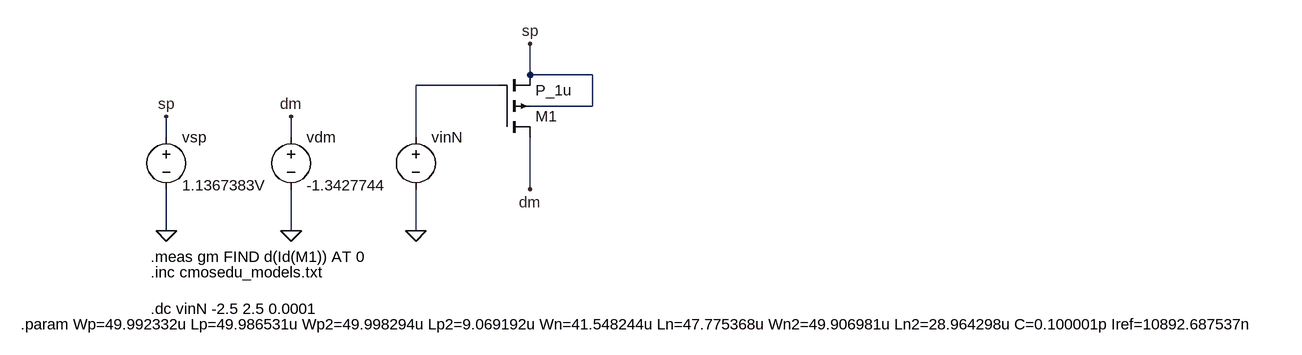
[diagram p0: schematic GM1.asc]
GM1.asc, the LTspice schematic file:
Version 4
SHEET 1 2468 680
WIRE 1056 -112 1056 -160
WIRE 1152 -112 1056 -112
WIRE 1008 -96 880 -96
WIRE 1152 -64 1152 -112
WIRE 1152 -64 1056 -64
WIRE 496 -16 496 -48
WIRE 688 -16 688 -48
WIRE 880 -16 880 -96
WIRE 1056 64 1056 -16
WIRE 496 128 496 64
WIRE 688 128 688 64
WIRE 880 128 880 64
FLAG 880 128 0
FLAG 496 -48 sp
FLAG 496 128 0
FLAG 1056 -160 sp
FLAG 688 -48 dm
FLAG 688 128 0
FLAG 1056 64 dm
SYMBOL voltage 880 -32 R0
WINDOW 3 24 44 Left 2
WINDOW 123 0 0 Left 2
WINDOW 39 0 0 Left 2
SYMATTR Value ""
SYMATTR InstName vinN
SYMBOL voltage 496 -32 R0
WINDOW 123 0 0 Left 2
WINDOW 39 0 0 Left 2
WINDOW 3 24 90 Left 2
SYMATTR Value 1.1367383V
SYMATTR InstName vsp
SYMBOL voltage 688 -32 R0
WINDOW 123 0 0 Left 2
WINDOW 39 0 0 Left 2
WINDOW 3 24 90 Left 2
SYMATTR Value -1.3427744
SYMATTR InstName vdm
SYMBOL pmos4 1008 -16 M180
SYMATTR InstName M1
SYMATTR Value2 l={Lp2} w={Wp2}
SYMATTR Value P_1u
TEXT 472 192 Left 2 !.inc cmosedu_models.txt
TEXT 472 248 Left 2 !.dc vinN -2.5 2.5 0.0001
TEXT 472 168 Left 2 !.meas gm FIND d(Id(M1)) AT 0
TEXT 272 272 Left 2 !.param Wp=49.992332u Lp=49.986531u Wp2=49.998294u Lp2=9.069192u Wn=41.548244u Ln=47.775368u Wn2=49.906981u Ln2=28.964298u C=0.100001p Iref=10892.687537n

The netlist it stands for:
* GM1.asc
vinN N001 0
vsp sp 0 1.1367383V
vdm dm 0 -1.3427744
M1 dm N001 sp sp P_1u l={Lp2} w={Wp2}
.model NMOS NMOS
.model PMOS PMOS
.lib standard.mos
.inc cmosedu_models.txt
.dc vinN -2.5 2.5 0.0001
.meas gm FIND d(Id(M1)) AT 0
.param Wp=49.992332u Lp=49.986531u Wp2=49.998294u Lp2=9.069192u Wn=41.548244u Ln=47.775368u Wn2=49.906981u Ln2=28.964298u C=0.100001p Iref=10892.687537n
.backanno
.end